# Altium schematic sheet Power_Supply_2.SchDoc
size A4; CompanyName: Technische Hochschule Nürnberg Georg Simon Ohm; Organization: UltraZohm; Address1: Kesslerplatz 12; Address2: 90489 Nürnberg; Address3: GERMANY; DocumentNumber: 11; SheetNumber: 11; SheetTotal: 12; Website: www.ultrazohm.com
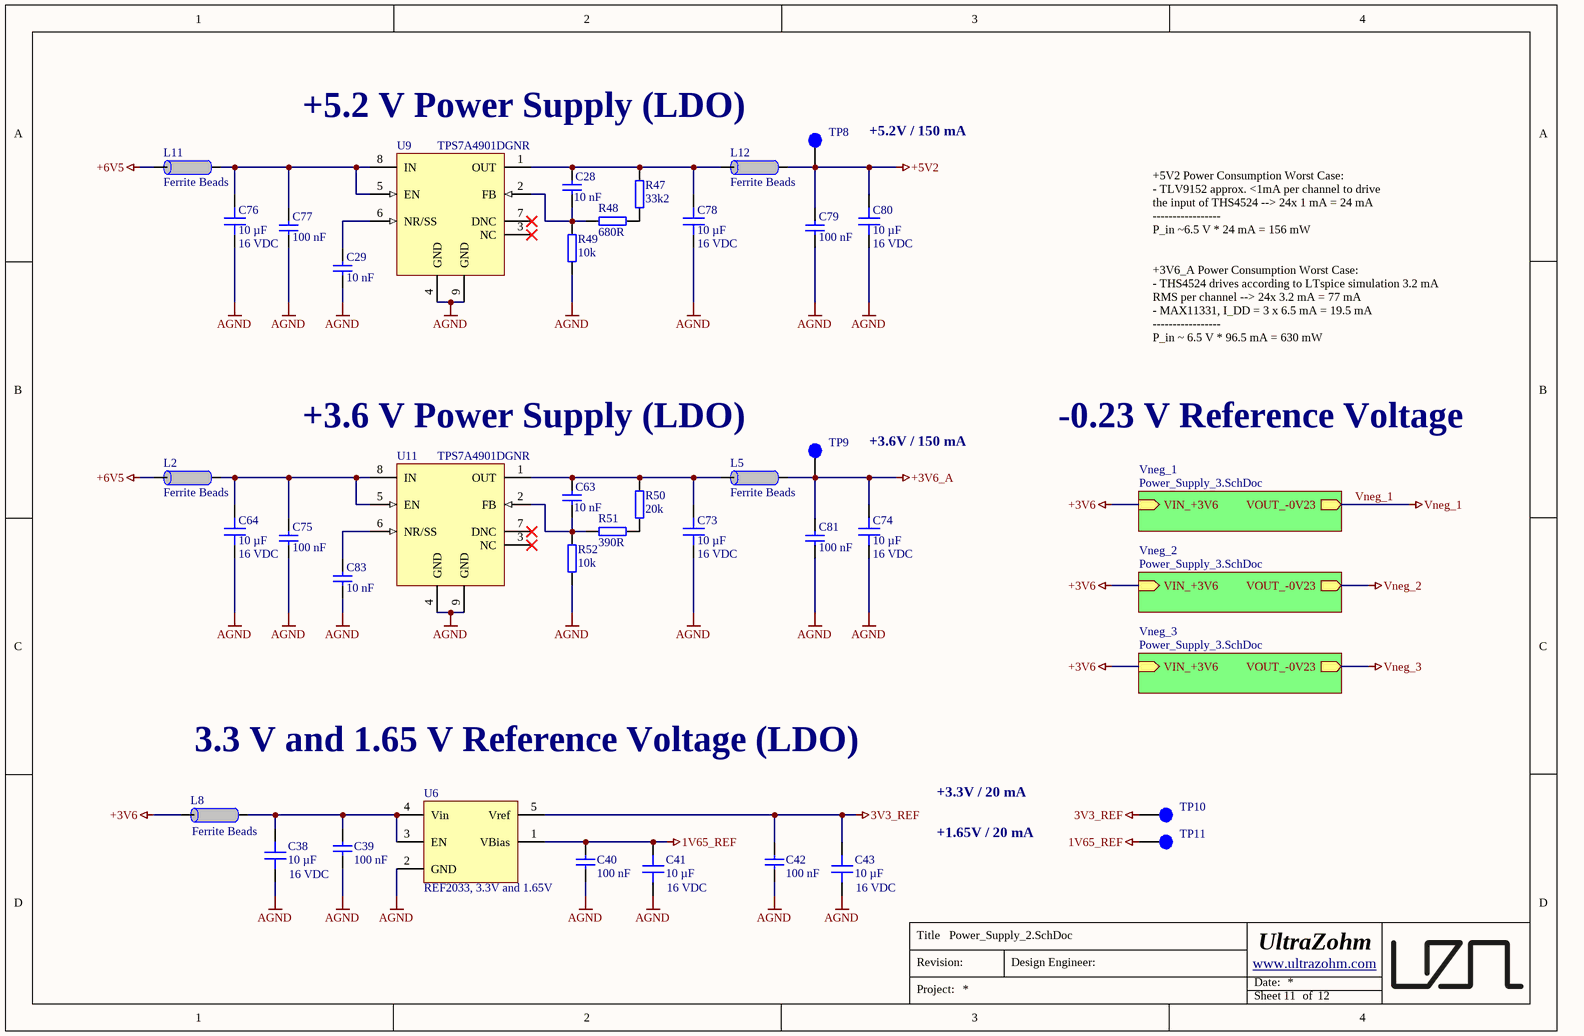
[diagram p0: Power_Supply_2.SchDoc]

## Parts
C28  10 nF  [C_0402_TE]
C29  10 nF  [C_0402_TE]
C38  10 µF  Voltage Rating: 16 VDC  [C_0603_TE]
C39  100 nF  [C_0603_TE]
C40  100 nF  [C_0603_TE]
C41  10 µF  Voltage Rating: 16 VDC  [C_0603_TE]
C42  100 nF  [C_0603_TE]
C43  10 µF  Voltage Rating: 16 VDC  [C_0603_TE]
C63  10 nF  [C_0402_TE]
C64  10 µF  Voltage Rating: 16 VDC  [C_0603_TE]
C73  10 µF  Voltage Rating: 16 VDC  [C_0603_TE]
C74  10 µF  Voltage Rating: 16 VDC  [C_0603_TE]
C75  100 nF  [C_0603_TE]
C76  10 µF  Voltage Rating: 16 VDC  [C_0603_TE]
C77  100 nF  [C_0603_TE]
C78  10 µF  Voltage Rating: 16 VDC  [C_0603_TE]
C79  100 nF  [C_0603_TE]
C80  10 µF  Voltage Rating: 16 VDC  [C_0603_TE]
C81  100 nF  [C_0603_TE]
C83  10 nF  [C_0402_TE]
L2  Component Type: Ferrite Beads  [INDC2012X92N_V]  (hidden comment: UPZ2012E601-2R0TF)
L5  Component Type: Ferrite Beads  [INDC2012X92N_V]  (hidden comment: UPZ2012E601-2R0TF)
L8  Component Type: Ferrite Beads  [INDC2012X92N_V]  (hidden comment: UPZ2012E601-2R0TF)
L11  Component Type: Ferrite Beads  [INDC2012X92N_V]  (hidden comment: UPZ2012E601-2R0TF)
L12  Component Type: Ferrite Beads  [INDC2012X92N_V]  (hidden comment: UPZ2012E601-2R0TF)
R47  33k2  [R_0402_TE]
R48  680R  [R_0402_TE]
R49  10k  [R_0402_TE]
R50  20k  [R_0402_TE]
R51  390R  [R_0402_TE]
R52  10k  [R_0402_TE]
TP8  Testpoint 1mm  [TP_1mm]  (value not drawn)  (no BOM)
TP9  Testpoint 1mm  [TP_1mm]  (value not drawn)  (no BOM)
TP10  Testpoint 1mm  [TP_1mm]  (value not drawn)  (no BOM)
TP11  Testpoint 1mm  [TP_1mm]  (value not drawn)  (no BOM)
U6  REF2033, 3.3V and 1.65V  [SOT23-5_N]
U9  TPS7A4901DGNR  [SOP65P490X110-9N]
U11  TPS7A4901DGNR  [SOP65P490X110-9N]

## Sub-sheets
Vneg_1 = Power_Supply_3.SchDoc: VIN_+3V6 (in), VOUT_-0V23 (out)
Vneg_2 = Power_Supply_3.SchDoc: VIN_+3V6 (in), VOUT_-0V23 (out)
Vneg_3 = Power_Supply_3.SchDoc: VIN_+3V6 (in), VOUT_-0V23 (out)

## Nets
1V65_REF: C40.2 C41.2 TP11.1 U6.1(VBias)
3V3_REF: C42.2 C43.2 TP10.1 U6.5(Vref)
+3V6: L8.2 ; sheet Vneg_1/VIN_+3V6, sheet Vneg_2/VIN_+3V6, sheet Vneg_3/VIN_+3V6
+3V6_A: C74.2 C81.2 L5.1 TP9.1
+5V2: C79.2 C80.2 L12.1 TP8.1
+6V5: L2.2 L11.2
AGND: C29.1 C38.1 C39.1 C40.1 C41.1 C42.1 C43.1 C64.1 C73.1 C74.1 C75.1 C76.1 C77.1 C78.1 C79.1 C80.1 C81.1 C83.1 R49.1 R52.1 U6.2(GND) U9.4(GND) U9.9(GND) U11.4(GND) U11.9(GND)
Vneg_1: sheet Vneg_1/VOUT_-0V23
Vneg_2: sheet Vneg_2/VOUT_-0V23
Vneg_3: sheet Vneg_3/VOUT_-0V23
NetC28_1: C28.1 R48.1 R49.2 U9.2(FB)
NetC28_2: C28.2 C78.2 L12.2 R47.2 U9.1(OUT)
NetC29_2: C29.2 U9.6(NR/SS)
NetC38_2: C38.2 C39.2 L8.1 U6.3(EN) U6.4(Vin)
NetC63_1: C63.1 R51.1 R52.2 U11.2(FB)
NetC63_2: C63.2 C73.2 L5.2 R50.2 U11.1(OUT)
NetC64_2: C64.2 C75.2 L2.1 U11.5(EN) U11.8(IN)
NetC76_2: C76.2 C77.2 L11.1 U9.5(EN) U9.8(IN)
NetC83_2: C83.2 U11.6(NR/SS)
NetR47_1: R47.1 R48.2
NetR50_1: R50.1 R51.2

Not connected (* = marked no-connect by the designer): U9 3(NC)* 7(DNC)*; U11 3(NC)* 7(DNC)*

## Notes on the sheet
- +5.2 V Power Supply (LDO)
- +5.2V / 150 mA
- +5V2 Power Consumption Worst Case:
  - TLV9152 approx. <1mA per channel to drive the input of THS4524 --> 24x 1 mA = 24 mA
  -----------------
  P_in ~6.5 V * 24 mA = 156 mW
- +3V6_A Power Consumption Worst Case:
  - THS4524 drives according to LTspice simulation 3.2 mA RMS per channel --> 24x 3.2 mA = 77 mA
  - MAX11331, I_DD = 3 x 6.5 mA = 19.5 mA
  -----------------
  P_in ~ 6.5 V * 96.5 mA = 630 mW
- +3.6 V Power Supply (LDO)
- +3.6V / 150 mA
- -0.23 V Reference Voltage
- 3.3 V and 1.65 V Reference Voltage (LDO)
- +3.3V / 20 mA
- +1.65V / 20 mA
- Title
- Revision:
- Design Engineer:
- Date:
- Project:
- Sheet
- of

## Library data of the parts
C28 C29 C63 C83 = UZgen_C_0402_10nF_50V_NP0: Generic capacitor; Manufacturer: UZgen; Voltage: 50V; Tolerance: 10 %; Created from: UZgenTool; Manufacturer Part Number: UZgen_C_0402_10nF_50V_NP0; PartID: 5709; Created On: 13.12.2024 11:08:46; Value: 10 nF; Device Package: 0402; Technology: NP0; Mounting Type: SMD; Last Updated: 13.12.2024 11:08:46
C38 C41 C43 C64 C73 C74 C76 C78 C80 = CL10A106MO8NQNC: Capacitor 0603, 16 VDC, 10 µF, X5R; Manufacturer: Samsung Electro-Mechanics; Tolerance: 20 %; Created from: AGeiger; Manufacturer Part Number: CL10A106MO8NQNC; PartID: 101; Created On: 22.08.2022 13:56:44; ComponentLink1Description: Datasheet; ComponentLink1URL: https://datasheet.lcsc.com/lcsc/1810261909_Samsung-Electro-Mechanics-CL10A106MO8NQNC_C92487.pdf; Component Type: Capacitor 0603; Device Package: 0603; Mounting Type: SMD; Operating Temperature: -55 - 85°C; Supplier 1: LCSC; Supplier Part Number 1: C92487; Type: Capacitor; Value: 10 µF; Live Cycle Status: 1; LCSC Part Number: C92487; Series: X5R
  C38 C41 C43: Last Updated: 19.11.2024 12:34:06
  C64 C73 C74 C76 C78 C80: Last Updated: 19.11.2024 12:40:46
C39 C40 C42 C75 C77 C79 C81 = UZgen_C_0603_100nF_50V_X7R: Generic capacitor; Manufacturer: UZgen; Tolerance: 10 %; Created from: AGeiger; Voltage: 50V; Manufacturer Part Number: UZgen_C_0603_100nF_50V_X7R; PartID: 1; Created On: 02.07.2024 14:42:23; Device Package: 0603; Last Updated: 08.08.2024 15:01:15; Mounting Type: SMD; Value: 100 nF; Technology: X7R
L2 L5 L8 L11 L12 = UPZ2012E601-2R0TF: 2A 1 90mΩ 600Ω@100MHz ±25% 0805  Ferrite Beads ROHS; Manufacturer: Sunlord; Value: 90 Ohm; Created from: AGeiger; Manufacturer Part Number: UPZ2012E601-2R0TF; PartID: 11; Created On: 03.09.2022 16:57:01; ComponentLink1Description: Datasheet; ComponentLink1URL: https://datasheet.lcsc.com/lcsc/2110091730_Sunlord-UPZ2012E601-2R0TF_C98308.pdf; Device Package: 0805; Last Updated: 03.09.2022 17:01:04; Mounting Type: SMD; Operating Temperature: -55 - 125 °C; Supplier 1: LCSC; Supplier Part Number 1: C98308; Type: Ferrite Bead; DC current: 2 A; Live Cycle Status: 1; LCSC Part Number: C98308
R47 = 0402WGF3322TCE: 62.5mW Thick Film Resistor 50V ±100ppm/℃ ±1% 33.2kΩ 0402 Chip Resistor - Surface Mount ROHS; Manufacturer: UNI-ROYAL; Created from: AGeiger; Value: 33k2; Tolerance: 1%; Manufacturer Part Number: 0402WGF3322TCE; PartID: 369; Created On: 08.08.2024 13:22:47; ComponentLink1Description: Datasheet; ComponentLink1URL: https://www.lcsc.com/datasheet/C122548.pdf; Component Type: SMD resistor; Device Package: 0402; Last Updated: 07.08.2025 14:20:31; Mounting Type: SMD; Supplier 1: LCSC; Supplier Part Number 1: C122548; Type: Resistor; Live Cycle Status: 1; LCSC Part Number: C122548
R48 = UZgen_R_0402_680R: Generic resistor; Manufacturer: UZgen; Tolerance: 1 %; Created from: UZgenTool; Manufacturer Part Number: UZgen_R_0402_680R; PartID: 73; Created On: 02.07.2024 17:29:46; Value: 680R; Device Package: 0402; Mounting Type: SMD; Last Updated: 02.07.2024 17:29:46
R49 R52 = UZgen_R_0402_10k: Generic resistor; Manufacturer: UZgen; Tolerance: 1 %; Created from: UZgenTool; Manufacturer Part Number: UZgen_R_0402_10k; PartID: 101; Created On: 02.07.2024 17:29:46; Value: 10k; Device Package: 0402; Mounting Type: SMD; Last Updated: 02.07.2024 17:29:46
R50 = UZgen_R_0402_20k: Generic resistor; Manufacturer: UZgen; Tolerance: 1 %; Created from: UZgenTool; Value: 20k; Manufacturer Part Number: UZgen_R_0402_20k; PartID: 108; Created On: 02.07.2024 17:29:46; Device Package: 0402; Last Updated: 02.07.2024 17:29:46; Mounting Type: SMD
R51 = UZgen_R_0402_390R: Generic resistor; Manufacturer: UZgen; Tolerance: 1 %; Created from: UZgenTool; Manufacturer Part Number: UZgen_R_0402_390R; PartID: 67; Created On: 02.07.2024 17:29:46; Value: 390R; Device Package: 0402; Mounting Type: SMD; Last Updated: 02.07.2024 17:29:46
TP8-TP11 = Testpoint_1mm: Manufacturer: UltraZohm; Created from: AGeiger; Created: 2018_06_25_AGeiger; Value: Testpoint 1mm; Manufacturer Part Number: Testpoint_1mm; PartID: 9; Created On: 20.09.2022 13:14:57; Component Type: Testpoint; Last Updated: 14.08.2025 11:47:07; Supplier 1: NULL; Supplier Part Number 1: NULL; Type: Testpoint; Live Cycle Status: 1
U6 = REF2033AIDDCT: REF20xx Low-Drift, Low-Power, Dual-Output, VREF and VREF / 2 Voltage References; Manufacturer: Texas Instruments; Created from: AGeiger; Digikey Part-Number: 296-40487-1-ND; Manufacturer Part Number: REF2033AIDDCT; PartID: 12; Created On: 20.09.2022 16:03:22; ComponentLink1Description: Datasheet; ComponentLink1URL: https://www.ti.com/lit/ds/symlink/ref2033.pdf?HQS=dis-mous-null-mousermode-dsf-pf-null-wwe&ts=1661952535444&ref_url=https%253A%252F%252Fwww.mouser.de%252F; Component Type: Voltage Reference; Device Package: SMD; Last Updated: 20.09.2022 16:03:22; Mounting Type: SMD; Operating Temperature: -40 - 125 °C; Series: REF20xx; Supplier 1: LCSC; Supplier Part Number 1: C181409; Type: Voltage Reference; Value: REF2033, 3.3V and 1.65V; Live Cycle Status: 1; LCSC Part Number: C181409; Stock number: not stored
U9 U11 = TPS7A4901DGNR: 36 V, -150 mA, ultralow-noise, positive linear regulator; Manufacturer: Texas Instruments; Value: -1.194 V - -33 V; Created from: AGeiger; ComponentLink1Description: Datasheet; ComponentLink1URL: https://www.ti.com/lit/ds/symlink/tps7a49.pdf?HQS=dis-mous-null-mousermode-dsf-pf-null-wwe&ts=1629794614893&ref_url=https%253A%252F%252Fwww.mouser.fr%252F; Supplier 1: Mouser; Supplier Part Number 1: 595-TPS7A4901DGNR; Supplier 2: LCSC; Supplier Part Number 2: C16430; Manufacturer Part Number: TPS7A4901DGNR; PartID: 6; Created On: 24.08.2021 11:34:06; Component Type: LDO; Device Package: HVSSOP-8; Last Updated: 11.08.2025 10:14:53; Mounting Type: SMD; Operating Temperature: -40 to +125 °C; Series: TPS7A4901; Type: LDO; Live Cycle Status: 1; Stock number: not stored; LCSC Part Number: C16430